# Altium schematic sheet Power.SchDoc: SR4K_PHY6222
size A4; Revision: V1.2; SheetNumber: 4; SheetTotal: 5
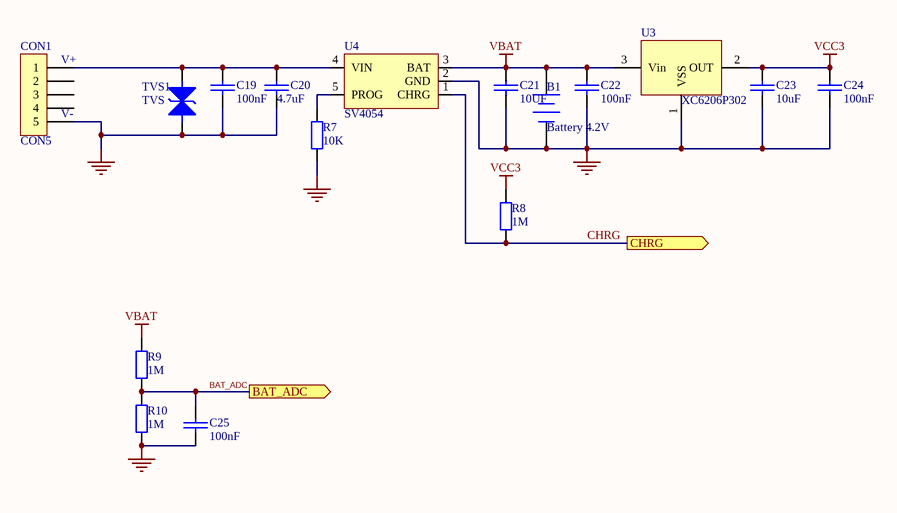
[diagram p0: Power.SchDoc]

## Parts
B1  Battery 4.2V  [JP2S]
C19  100nF  [0603]
C20  4.7uF  [0603]
C21  10UF  [0603]
C22  100nF  [0603]
C23  10uF  [0603]
C24  100nF  [0603]
C25  100nF
CON1  CON5
R7  10K  [AXIAL-0.4]
R8  1M
R9  1M
R10  1M
TVS1  TVS  [SOD-123]
U3  XC6206P302  [SOT-23]
U4  SV4054  [SOT-25]

## Ports
BAT_ADC (out), CHRG (out)

## Nets
GND: B1.2(-) C19.1 C20.1 C21.1 C22.1 C23.1 C24.1 C25.1 CON1.5 R7.1 R10.1 TVS1.1 U3.1(VSS) U4.2(GND)
VBAT: B1.1(+) C21.2 C22.2 R9.2 U3.3(Vin) U4.3(BAT)
VCC3: C23.2 C24.2 R8.2 U3.2(OUT)
BAT_ADC: C25.2 R9.1 R10.2 ; port BAT_ADC
CHRG: R8.1 U4.1(CHRG) ; port CHRG
NetC19_2: C19.2 C20.2 CON1.1 TVS1.2 U4.4(VIN)
NetR7_2: R7.2 U4.5(PROG)

Not connected (* = marked no-connect by the designer): CON1 2 3 4

## Notes on the sheet
- (near CON1) V+
- (near CON1) V-
- Title
- Size:
- Date:
- A4
- Number:
- Time:
- Revision:
- Sheet
- emmovo@outlook.com
- of
- File:

## Library data of the parts
B1 = Battery: Multicell Battery; Published: 24-Mar-1999; LatestRevisionDate: 17-Jul-2002; LatestRevisionNote: Re-released for DXP Platform.; PackageReference: BAT-2; Publisher: Altium Limited; PackageDescription: Battery; 2 Leads
C19-C25 = CAP: Capacitor
CON1 = CON5: Connector
R7 = Res2: 1%@100mA; Published: 8-Jun-2000; LatestRevisionDate: 17-Jul-2002; LatestRevisionNote: Re-released for DXP Platform.; PackageReference: AXIAL-0.4; Publisher: Altium Limited; PackageDescription: Axial Device, Thru-Hole; 2 Leads; 0.4 in Pin Spacing; Value: 10K
R8-R10 = Res2: Published: 8-Jun-2000; LatestRevisionDate: 17-Jul-2002; LatestRevisionNote: Re-released for DXP Platform.; PackageReference: AXIAL-0.4; Publisher: Altium Limited; PackageDescription: Axial Device, Thru-Hole; 2 Leads; 0.4 in Pin Spacing; Value: 1M